# Altium project BEE-DAL_EXP.PrjPcb (part 2 of 2)

## Sheet STEP_MOTOR_DRIVER_2.SchDoc
size 420 x 297 mm; SheetNumber: 12; SheetTotal: 20
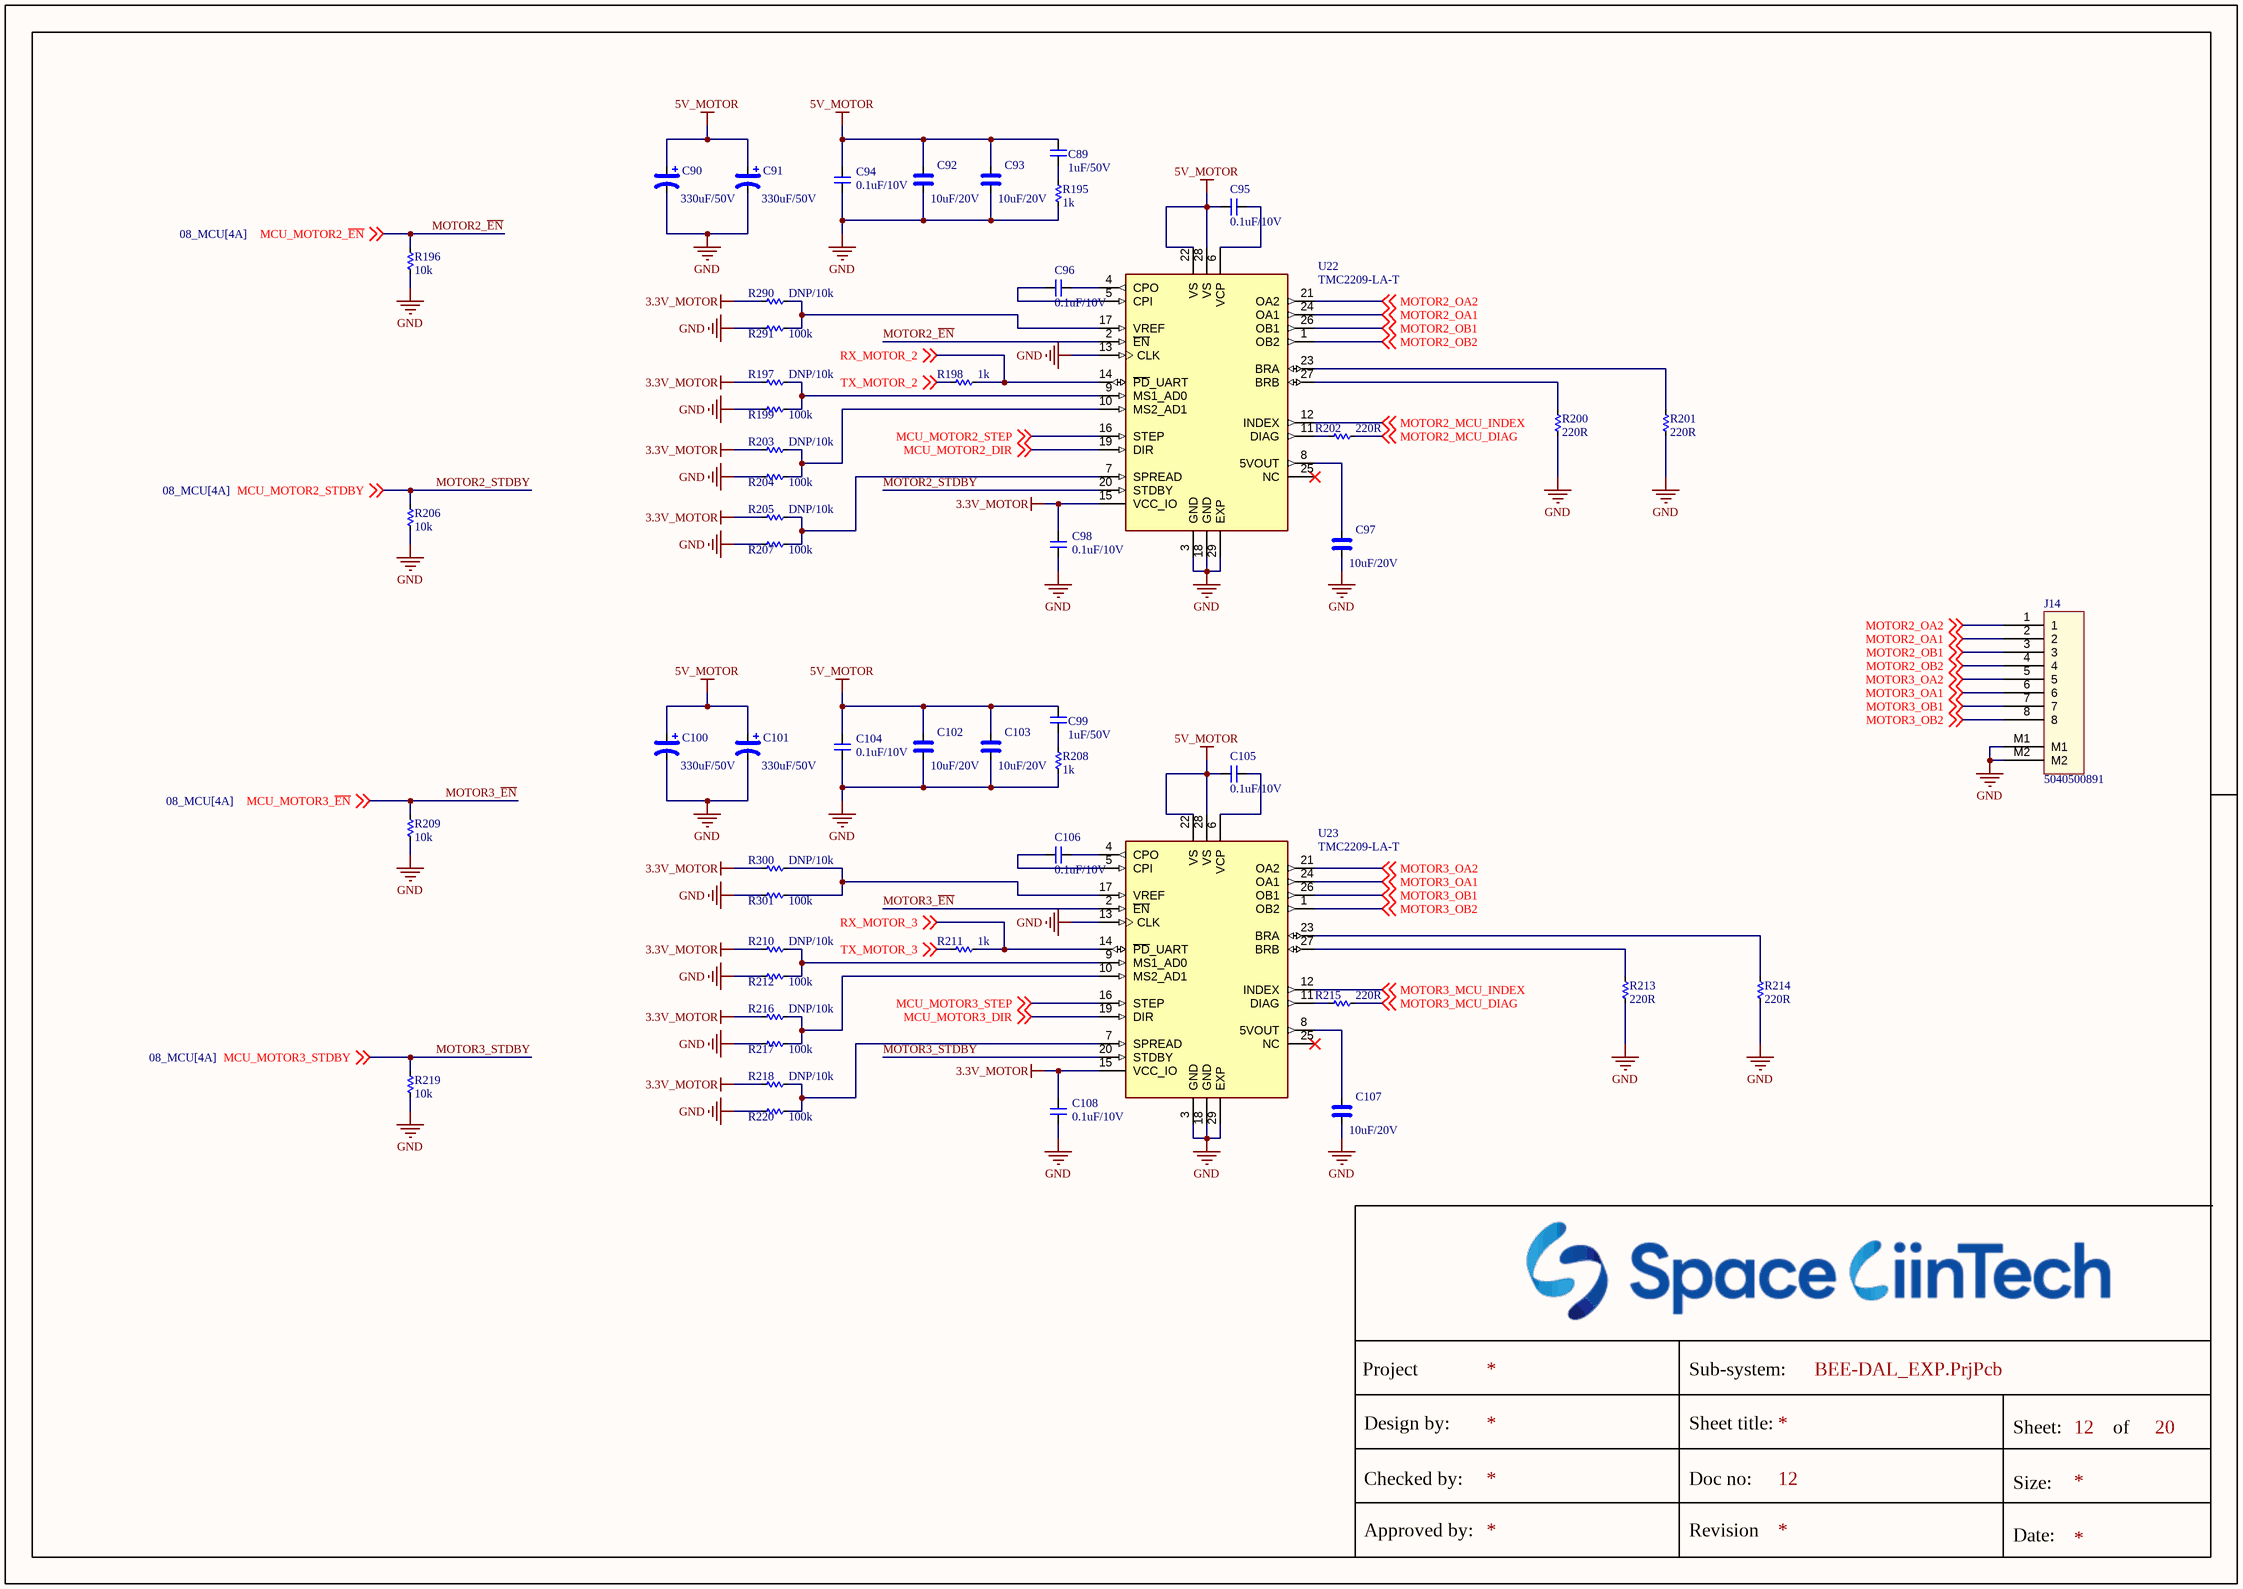
[diagram p15: STEP_MOTOR_DRIVER_2.SchDoc]

### Parts
C89  1uF/50V  [CAP_C_1005X50_L]
C90  330uF/50V  [CAP_MP_3216X180]
C91  330uF/50V  [CAP_MP_3216X180]
C92  10uF/20V  [CAP_C_2012X110]
C93  10uF/20V  [CAP_C_2012X110]
C94  0.1uF/10V  [CAP_C_1005X50_L]
C95  0.1uF/10V  [CAP_C_1005X50_L]
C96  0.1uF/10V  [CAP_C_1005X50_L]
C97  10uF/20V  [CAP_C_2012X110]
C98  0.1uF/10V  [CAP_C_1005X50_L]
C99  1uF/50V  [CAP_C_1005X50_L]
C100  330uF/50V  [CAP_MP_3216X180]
C101  330uF/50V  [CAP_MP_3216X180]
C102  10uF/20V  [CAP_C_2012X110]
C103  10uF/20V  [CAP_C_2012X110]
C104  0.1uF/10V  [CAP_C_1005X50_L]
C105  0.1uF/10V  [CAP_C_1005X50_L]
C106  0.1uF/10V  [CAP_C_1005X50_L]
C107  10uF/20V  [CAP_C_2012X110]
C108  0.1uF/10V  [CAP_C_1005X50_L]
J14  5040500891  [MOLEX_5040500891]
R195  1k  [RES_C_1005X40]
R196  10k  [RES_C_1005X40]
R197  DNP/10k  [RES_C_1005X40]
R198  1k  [RES_C_1005X40]
R199  100k  [RES_C_1005X40]
R200  220R  [RES_C_1005X40]
R201  220R  [RES_C_1005X40]
R202  220R  [RES_C_1005X40]
R203  DNP/10k  [RES_C_1005X40]
R204  100k  [RES_C_1005X40]
R205  DNP/10k  [RES_C_1005X40]
R206  10k  [RES_C_1005X40]
R207  100k  [RES_C_1005X40]
R208  1k  [RES_C_1005X40]
R209  10k  [RES_C_1005X40]
R210  DNP/10k  [RES_C_1005X40]
R211  1k  [RES_C_1005X40]
R212  100k  [RES_C_1005X40]
R213  220R  [RES_C_1005X40]
R214  220R  [RES_C_1005X40]
R215  220R  [RES_C_1005X40]
R216  DNP/10k  [RES_C_1005X40]
R217  100k  [RES_C_1005X40]
R218  DNP/10k  [RES_C_1005X40]
R219  10k  [RES_C_1005X40]
R220  100k  [RES_C_1005X40]
R290  DNP/10k  [RES_C_1005X40]
R291  100k  [RES_C_1005X40]
R300  DNP/10k  [RES_C_1005X40]
R301  100k  [RES_C_1005X40]
U22  TMC2209-LA-T  [QFN50P500X500X90-29N]
U23  TMC2209-LA-T  [QFN50P500X500X90-29N]

### Nets
3.3V_MOTOR: C98.2 C108.2 R197.2 R203.2 R205.2 R210.2 R216.2 R218.2 R290.2 R300.2 U22.15(VCC_IO) U23.15(VCC_IO)
5V_MOTOR: C89.2 C90.1 C91.1 C92.1 C93.1 C94.2 C95.2 C99.2 C100.1 C101.1 C102.1 C103.1 C104.2 C105.2 U22.22(VS) U22.28(VS) U23.22(VS) U23.28(VS)
GND: C90.2 C91.2 C92.2 C93.2 C94.1 C97.2 C98.1 C100.2 C101.2 C102.2 C103.2 C104.1 C107.2 C108.1 J14.M1 J14.M2 R195.1 R196.1 R199.2 R200.2 R201.2 R204.2 R206.1 R207.2 R208.1 R209.1 R212.2 R213.2 R214.2 R217.2 R219.1 R220.2 R291.2 R301.2 U22.3(GND) U22.13(CLK) U22.18(GND) U22.29(EXP) U23.3(GND) U23.13(CLK) U23.18(GND) U23.29(EXP)
MCU_MOTOR2_DIR: U22.19(DIR) ; off-sheet MCU_MOTOR2_DIR
MCU_MOTOR2_STEP: U22.16(STEP) ; off-sheet MCU_MOTOR2_STEP
MCU_MOTOR3_DIR: U23.19(DIR) ; off-sheet MCU_MOTOR3_DIR
MCU_MOTOR3_STEP: U23.16(STEP) ; off-sheet MCU_MOTOR3_STEP
MOTOR2_~{EN}: R196.2 U22.2(~{EN}) ; off-sheet MCU_MOTOR2_~{EN}  [also labelled MCU_MOTOR2_~{EN}]
MOTOR2_MCU_DIAG: R202.2 ; off-sheet MOTOR2_MCU_DIAG
MOTOR2_MCU_INDEX: U22.12(INDEX) ; off-sheet MOTOR2_MCU_INDEX
MOTOR2_OA1: J14.2 U22.24(OA1) ; off-sheet MOTOR2_OA1
MOTOR2_OA2: J14.1 U22.21(OA2) ; off-sheet MOTOR2_OA2
MOTOR2_OB1: J14.3 U22.26(OB1) ; off-sheet MOTOR2_OB1
MOTOR2_OB2: J14.4 U22.1(OB2) ; off-sheet MOTOR2_OB2
MOTOR2_STDBY: R206.2 U22.20(STDBY) ; off-sheet MCU_MOTOR2_STDBY  [also labelled MCU_MOTOR2_STDBY]
MOTOR3_~{EN}: R209.2 U23.2(~{EN}) ; off-sheet MCU_MOTOR3_~{EN}  [also labelled MCU_MOTOR3_~{EN}]
MOTOR3_MCU_DIAG: R215.2 ; off-sheet MOTOR3_MCU_DIAG
MOTOR3_MCU_INDEX: U23.12(INDEX) ; off-sheet MOTOR3_MCU_INDEX
MOTOR3_OA1: J14.6 U23.24(OA1) ; off-sheet MOTOR3_OA1
MOTOR3_OA2: J14.5 U23.21(OA2) ; off-sheet MOTOR3_OA2
MOTOR3_OB1: J14.7 U23.26(OB1) ; off-sheet MOTOR3_OB1
MOTOR3_OB2: J14.8 U23.1(OB2) ; off-sheet MOTOR3_OB2
MOTOR3_STDBY: R219.2 U23.20(STDBY) ; off-sheet MCU_MOTOR3_STDBY  [also labelled MCU_MOTOR3_STDBY]
RX_MOTOR_2: R198.2 U22.14(~{PD}_UART) ; off-sheet RX_MOTOR_2
RX_MOTOR_3: R211.2 U23.14(~{PD}_UART) ; off-sheet RX_MOTOR_3
TX_MOTOR_2: R198.1 ; off-sheet TX_MOTOR_2
TX_MOTOR_3: R211.1 ; off-sheet TX_MOTOR_3
NetC89_1: C89.1 R195.2
NetC95_1: C95.1 U22.6(VCP)
NetC96_1: C96.1 U22.4(CPO)
NetC96_2: C96.2 U22.5(CPI)
NetC97_1: C97.1 U22.8(5VOUT)
NetC99_1: C99.1 R208.2
NetC105_1: C105.1 U23.6(VCP)
NetC106_1: C106.1 U23.4(CPO)
NetC106_2: C106.2 U23.5(CPI)
NetC107_1: C107.1 U23.8(5VOUT)
NetR197_1: R197.1 R199.1 U22.9(MS1_AD0)
NetR200_1: R200.1 U22.27(BRB)
NetR201_1: R201.1 U22.23(BRA)
NetR202_1: R202.1 U22.11(DIAG)
NetR203_1: R203.1 R204.1 U22.10(MS2_AD1)
NetR205_1: R205.1 R207.1 U22.7(SPREAD)
NetR210_1: R210.1 R212.1 U23.9(MS1_AD0)
NetR213_1: R213.1 U23.27(BRB)
NetR214_1: R214.1 U23.23(BRA)
NetR215_1: R215.1 U23.11(DIAG)
NetR216_1: R216.1 R217.1 U23.10(MS2_AD1)
NetR218_1: R218.1 R220.1 U23.7(SPREAD)
NetR290_1: R290.1 R291.1 U22.17(VREF)
NetR300_1: R300.1 R301.1 U23.17(VREF)

Not connected (* = marked no-connect by the designer): U22 25(NC)*; U23 25(NC)*

### Notes on the sheet
- Project
- Sub-system:
- Design by:
- Sheet title:
- Sheet:
- of
- Checked by:
- Approved by:
- Doc no:
- Revision
- Size:
- Date:

### Library data of the parts
C89 C94-C96 C98 C99 C104-C106 C108 = _CAP_C_2: CAP
C90 C91 C100 C101 = _CAP_Pola_High_2: CAP Polarization High Value
C92 C93 C97 C102 C103 C107 = _CAP_C_High_2: CAP High Value
J14 = Header 8x1_2M
R195-R220 R290 R291 R300 R301 = _RES_B_2: RES
U22 U23 = TMC2209-LA-T: Bipolar Motor Driver Power MOSFET Step/Direction, UART 28-QFN (5x5); MF: Trinamic Motion Control GmbH; SnapEDA_Link: https://www.snapeda.com/parts/TMC2209-LA-T/Trinamic/view-part/?ref=snap; Package: VFQFN-28 Trinamic; Value: *; MP: TMC2209-LA-T; Check_prices: https://www.snapeda.com/parts/TMC2209-LA-T/Trinamic/view-part/?ref=eda

## Sheet STEP_MOTOR_ISOLATOR_INPUT.SchDoc
size 420 x 297 mm; SheetNumber: 12; SheetTotal: 19
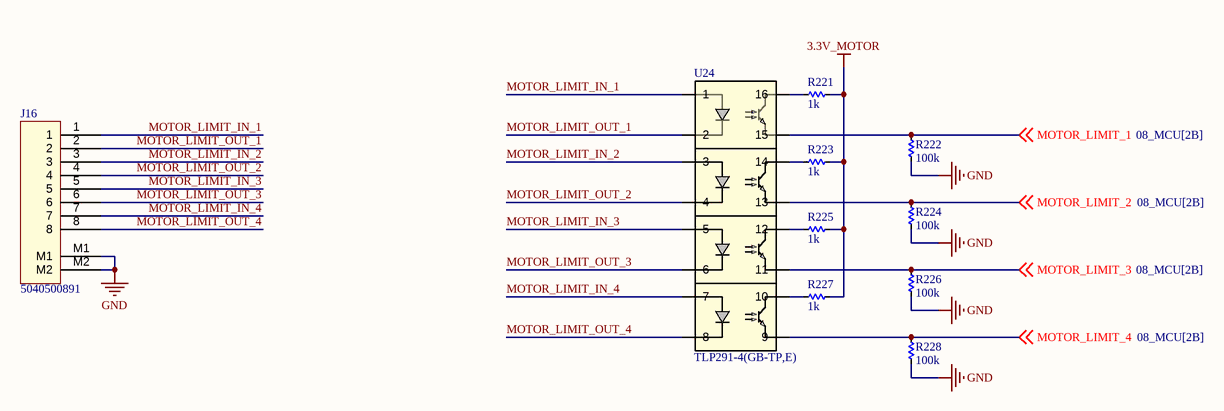
[diagram p16: STEP_MOTOR_ISOLATOR_INPUT.SchDoc]

### Parts
J16  5040500891  [MOLEX_5040500891]
R221  1k  [RES_C_1005X40]
R222  100k  [RES_C_1005X40]
R223  1k  [RES_C_1005X40]
R224  100k  [RES_C_1005X40]
R225  1k  [RES_C_1005X40]
R226  100k  [RES_C_1005X40]
R227  1k  [RES_C_1005X40]
R228  100k  [RES_C_1005X40]
U24  TLP291-4(GB-TP,E)  [SO16_TOS]

### Nets
3.3V_MOTOR: R221.1 R223.1 R225.1 R227.1
GND: J16.M1 J16.M2 R222.1 R224.1 R226.1 R228.1
MOTOR_LIMIT_1: R222.2 U24.15 ; off-sheet MOTOR_LIMIT_1
MOTOR_LIMIT_2: R224.2 U24.13 ; off-sheet MOTOR_LIMIT_2
MOTOR_LIMIT_3: R226.2 U24.11 ; off-sheet MOTOR_LIMIT_3
MOTOR_LIMIT_4: R228.2 U24.9 ; off-sheet MOTOR_LIMIT_4
MOTOR_LIMIT_IN_1: J16.1 U24.1
MOTOR_LIMIT_IN_2: J16.3 U24.3
MOTOR_LIMIT_IN_3: J16.5 U24.5
MOTOR_LIMIT_IN_4: J16.7 U24.7
MOTOR_LIMIT_OUT_1: J16.2 U24.2
MOTOR_LIMIT_OUT_2: J16.4 U24.4
MOTOR_LIMIT_OUT_3: J16.6 U24.6
MOTOR_LIMIT_OUT_4: J16.8 U24.8
NetR221_2: R221.2 U24.16
NetR223_2: R223.2 U24.14
NetR225_2: R225.2 U24.12
NetR227_2: R227.2 U24.10

### Notes on the sheet
- Project
- Sub-system:
- Design by:
- Sheet title:
- Sheet:
- of
- Checked by:
- Approved by:
- Doc no:
- Revision
- Size:
- Date:

### Library data of the parts
J16 = Header 8x1_2M
R221-R228 = _RES_B_2: RES
U24 = TLP291-4GB-TP,E: Description; Manufacturer_Name: Toshiba Electronic Devices & Storage Corp.; Source_Package: TLP291_4; Number_devices_in_Package: 1; Copyright: Copyright (C) 2026 Ultra Librarian. All rights reserved.; Manufacturer_Part_Number: TLP291-4(GB-TP,E); RefDes: Refdes; Type: Type

## Sheet CONNECTOR_INTERFACE.SchDoc
size 420 x 297 mm; SheetNumber: 14; SheetTotal: 20
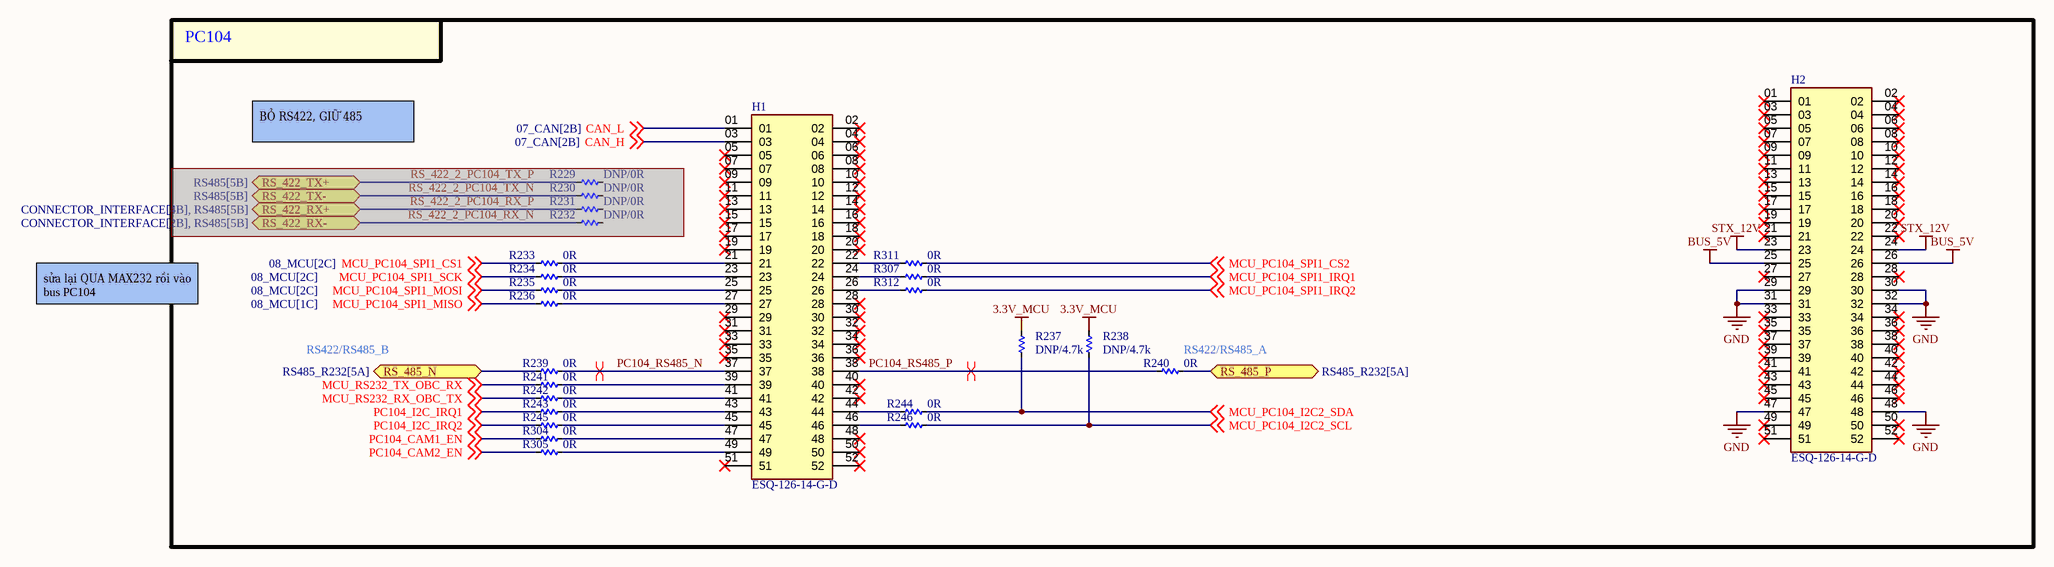
[diagram p17: CONNECTOR_INTERFACE.SchDoc]

### Parts
(Parts that share a designator on the sheet are numbered #1, #2 ... from top to bottom, then left to right.)
H1  ESQ-126-14-G-D  [SAMTEC_ESQ-126-14-G-D]
H2  ESQ-126-14-G-D  [SAMTEC_ESQ-126-14-G-D]
R229  DNP/0R  [RES_C_1005x30_L]  (masked out: inside a compile mask, not in the netlist)
R230  DNP/0R  [RES_C_1005x30_L]  (masked out: inside a compile mask, not in the netlist)
R231#2  DNP/0R  [RES_C_1005x30_L]  (masked out: inside a compile mask, not in the netlist)
R232#2  DNP/0R  [RES_C_1005x30_L]  (masked out: inside a compile mask, not in the netlist)
R233  0R  [RES_C_1005x30_L]
R234  0R  [RES_C_1005x30_L]
R235  0R  [RES_C_1005x30_L]
R236  0R  [RES_C_1005x30_L]
R237  DNP/4.7k  [RES_C_1005x30_L]
R238  DNP/4.7k  [RES_C_1005x30_L]
R239  0R  [RES_C_1005x30_L]
R240  0R  [RES_C_1005x30_L]
R241  0R  [RES_C_1005x30_L]
R242  0R  [RES_C_1005x30_L]
R243  0R  [RES_C_1005x30_L]
R244  0R  [RES_C_1005x30_L]
R245  0R  [RES_C_1005x30_L]
R246  0R  [RES_C_1005x30_L]
R304  0R  [RES_C_1005x30_L]
R305  0R  [RES_C_1005x30_L]
R307  0R  [RES_C_1005x30_L]
R311  0R  [RES_C_1005x30_L]
R312  0R  [RES_C_1005x30_L]

### Ports
RS_422_RX+ (bidir, see CONNECTOR_INTERFACE[4B], RS485[5B]), RS_422_RX- (bidir, see CONNECTOR_INTERFACE[2B], RS485[5B]), RS_422_TX+ (bidir, see RS485[5B]), RS_422_TX- (bidir, see RS485[5B]), RS_485_N (bidir, see RS485_R232[5A]), RS_485_P (bidir, see RS485_R232[5A])

### Nets
3.3V_MCU: R237.2 R238.2
BUS_5V: H2.25 H2.26
GND: H2.29 H2.30 H2.31 H2.32 H2.47 H2.48
STX_12V: H2.23 H2.24
CAN_H: H1.03 ; off-sheet CAN_H
CAN_L: H1.01 ; off-sheet CAN_L
MCU_PC104_I2C2_SCL: R238.1 R246.2 ; off-sheet MCU_PC104_I2C2_SCL
MCU_PC104_I2C2_SDA: R237.1 R244.2 ; off-sheet MCU_PC104_I2C2_SDA
MCU_PC104_SPI1_CS1: R233.1 ; off-sheet MCU_PC104_SPI1_CS1
MCU_PC104_SPI1_CS2: R311.1 ; off-sheet MCU_PC104_SPI1_CS2
MCU_PC104_SPI1_IRQ1: R307.2 ; off-sheet MCU_PC104_SPI1_IRQ1
MCU_PC104_SPI1_IRQ2: R312.2 ; off-sheet MCU_PC104_SPI1_IRQ2
MCU_PC104_SPI1_MISO: R236.1 ; off-sheet MCU_PC104_SPI1_MISO
MCU_PC104_SPI1_MOSI: R235.1 ; off-sheet MCU_PC104_SPI1_MOSI
MCU_PC104_SPI1_SCK: R234.1 ; off-sheet MCU_PC104_SPI1_SCK
MCU_RS232_RX_OBC_TX: R242.1 ; off-sheet MCU_RS232_RX_OBC_TX
MCU_RS232_TX_OBC_RX: R241.1 ; off-sheet MCU_RS232_TX_OBC_RX
PC104_CAM1_EN: R304.1 ; off-sheet PC104_CAM1_EN
PC104_CAM2_EN: R305.1 ; off-sheet PC104_CAM2_EN
PC104_I2C_IRQ1: R243.1 ; off-sheet PC104_I2C_IRQ1
PC104_I2C_IRQ2: R245.1 ; off-sheet PC104_I2C_IRQ2
PC104_RS485_N: H1.37 R239.2
PC104_RS485_P: H1.38 R240.1
NetH1_21: H1.21 R233.2
NetH1_22: H1.22 R311.2
NetH1_23: H1.23 R234.2
NetH1_24: H1.24 R307.1
NetH1_25: H1.25 R235.2
NetH1_26: H1.26 R312.1
NetH1_27: H1.27 R236.2
NetH1_39: H1.39 R241.2
NetH1_41: H1.41 R242.2
NetH1_43: H1.43 R243.2
NetH1_44: H1.44 R244.1
NetH1_45: H1.45 R245.2
NetH1_46: H1.46 R246.1
NetH1_47: H1.47 R304.2
NetH1_49: H1.49 R305.2
NetR239_1: R239.1 ; port RS_485_N
NetR240_2: R240.2 ; port RS_485_P

Not connected (* = marked no-connect by the designer): H1 02* 04* 05* 06* 07* 08* 09* 10* 11* 12* 13* 14* 15* 16* 17* 18* 19* 20* 28* 29* 30* 31* 32* 33* 34* 35* 36* 40* 42* 48* 50* 51* 52*; H2 01* 02* 03* 04* 05* 06* 07* 08* 09* 10* 11* 12* 13* 14* 15* 16* 17* 18* 19* 20* 21* 22* 27* 28* 33* 34* 35* 36* 37* 38* 39* 40* 41* 42* 43* 44* 45* 46* 49* 50* 51* 52*

### Layout directives
differential pair: PC104_RS485_N, PC104_RS485_P

### Notes on the sheet
- PC104
- BỎ RS422, GIỮ 485
- sửa lại QUA MAX232 rồi vào bus PC104
- RS422/RS485_B
- (near R240) RS422/RS485_A
- Project:
- Sub-system:
- Design by:
- Sheet title:
- Sheet
- A3
- of
- Checked by:
- Approved by:
- Revision:
- Document No:
- Size:
- Date:

### Library data of the parts
H1 H2 = ESQ-126-14-G-D: CONN SOCKET 52POS 0.1 GOLD PCB; MF: Samtec; MP: ESQ-126-14-G-D; Price: None; Package: None; Value: *; Availability: Unavailable
R229 R230 R231#2 R232#2 R233-R246 R304 R305 R307 R311 R312 = _RES_B_2: RES

## Sheet POWER_MEASUREMENT.SchDoc
size 420 x 297 mm; SheetNumber: 15; SheetTotal: 20
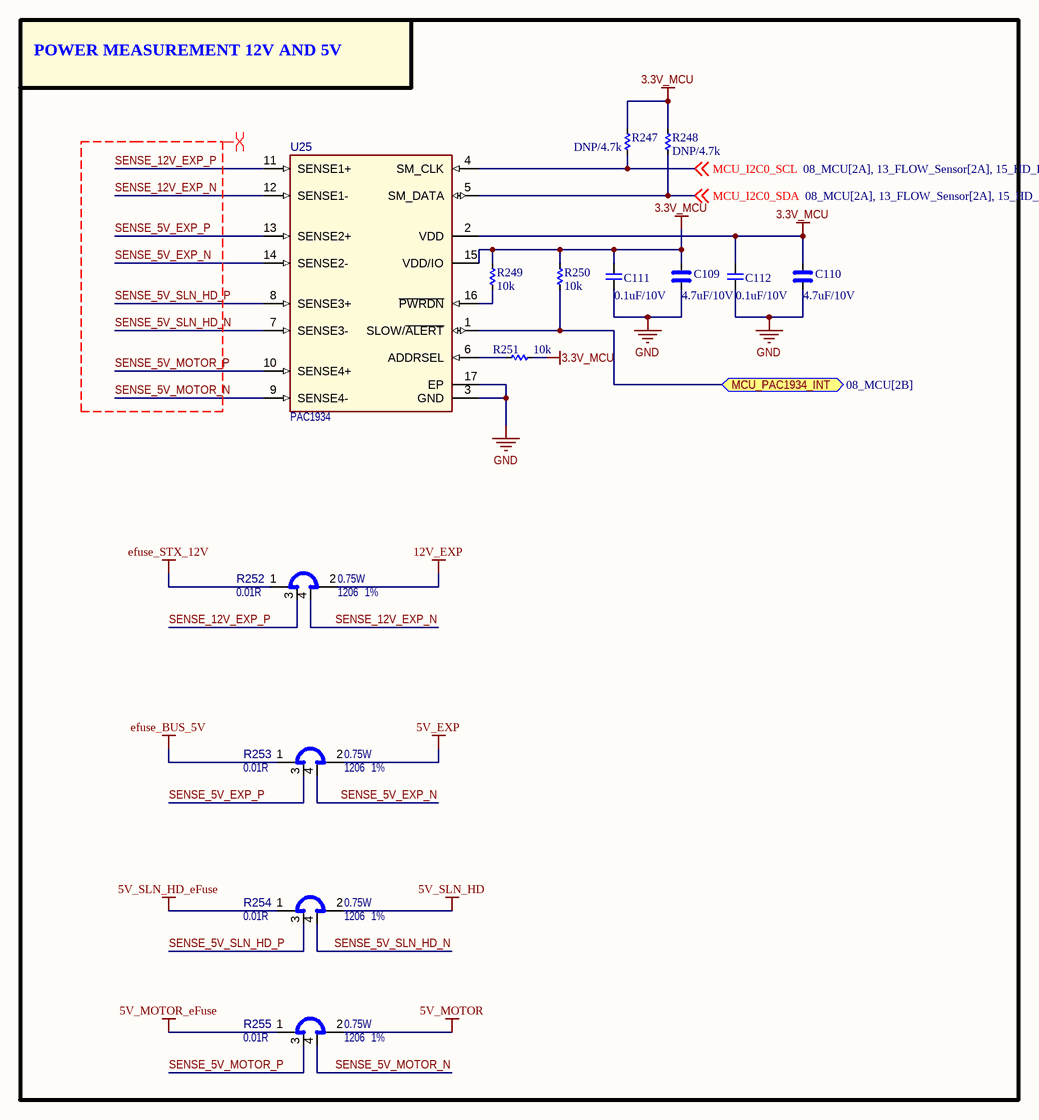
[diagram p18: POWER_MEASUREMENT.SchDoc]

### Parts
C109  4.7uF/10V  [CAP_C_1005X50_L]
C110  4.7uF/10V  [CAP_C_1005X50_L]
C111  0.1uF/10V  [CAP_C_1005X50_L]
C112  0.1uF/10V  [CAP_C_1005X50_L]
R247  DNP/4.7k  [RES_C_1005x30_L]
R248  DNP/4.7k  [RES_C_1005x30_L]
R249  10k  [RES_C_1005x30_L]
R250  10k  [RES_C_1005x30_L]
R251  10k  [RES_C_1005x30_L]
R252  value 0.01R  Package: 1206  Tolerance: 1%  Power: 0.75W  [RES_C_1206_SHUNT]  (hidden comment: KRL1632E-M-R010-F-T5)
R253  value 0.01R  Package: 1206  Tolerance: 1%  Power: 0.75W  [RES_C_1206_SHUNT]  (hidden comment: KRL1632E-M-R010-F-T5)
R254  value 0.01R  Package: 1206  Tolerance: 1%  Power: 0.75W  [RES_C_1206_SHUNT]  (hidden comment: KRL1632E-M-R010-F-T5)
R255  value 0.01R  Package: 1206  Tolerance: 1%  Power: 0.75W  [RES_C_1206_SHUNT]  (hidden comment: KRL1632E-M-R010-F-T5)
U25  value PAC1934  [UQFN-16_4X4_EP2.6X2.6]  (hidden comment: PAC1934 UQFN-16)

### Blocks framed on the sheet
POWER MEASUREMENT 12V AND 5V: C109-C112 R247-R255 U25

### Ports
MCU_PAC1934_INT (bidir, see 08_MCU[2B])

### Nets
3.3V_MCU: C109.1 C110.1 C111.1 C112.1 R247.1 R248.1 R249.1 R250.1 R251.2 U25.2(VDD) U25.15(VDD/IO)
5V_EXP: R253.2
5V_MOTOR: R255.2
5V_MOTOR_eFuse: R255.1
5V_SLN_HD: R254.2
5V_SLN_HD_eFuse: R254.1
12V_EXP: R252.2
efuse_BUS_5V: R253.1
efuse_STX_12V: R252.1
GND: C109.2 C110.2 C111.2 C112.2 U25.3(GND) U25.17(EP)
MCU_I2C0_SCL: R247.2 U25.4(SM_CLK) ; off-sheet MCU_I2C0_SCL
MCU_I2C0_SDA: R248.2 U25.5(SM_DATA) ; off-sheet MCU_I2C0_SDA
SENSE_5V_EXP_N: R253.4 U25.14(SENSE2-)
SENSE_5V_EXP_P: R253.3 U25.13(SENSE2+)
SENSE_5V_MOTOR_N: R255.4 U25.9(SENSE4-)
SENSE_5V_MOTOR_P: R255.3 U25.10(SENSE4+)
SENSE_5V_SLN_HD_N: R254.4 U25.7(SENSE3-)
SENSE_5V_SLN_HD_P: R254.3 U25.8(SENSE3+)
SENSE_12V_EXP_N: R252.4 U25.12(SENSE1-)
SENSE_12V_EXP_P: R252.3 U25.11(SENSE1+)
NetR61_2: R250.2 U25.1(SLOW/~{ALERT}) ; port MCU_PAC1934_INT
NetR249_2: R249.2 U25.16(~{PWRDN})
NetR251_1: R251.1 U25.6(ADDRSEL)

### Layout directives
differential pair: SENSE_5V_EXP_N, SENSE_5V_EXP_P, SENSE_5V_MOTOR_N, SENSE_5V_MOTOR_P, SENSE_5V_SLN_HD_N, SENSE_5V_SLN_HD_P, SENSE_12V_EXP_N, SENSE_12V_EXP_P

### Notes on the sheet
- Project
- Sub-system:
- Design by:
- Sheet title:
- Sheet:
- of
- Checked by:
- Approved by:
- Doc no:
- Revision
- Size:
- Date:

### Library data of the parts
C109 C110 = _CAP_C_High_2: CAP
C111 C112 = _CAP_C_2: CAP
R247-R251 = _RES_B_2: RES
R252-R255 = RSMT1316: Shunt; Manufacturer 1: SUSUMU; Description_: RES SHUNT MF 0.01R 1% 0.75W SMD 1206; Dev Tools Status: Design; Temperature Coeffcient: 50ppm/C; Current: 8A; Owner: Ciprian Abramov; Populated: YES; MCHP-ID: RSMT1316; Revision: 1; Symbol: Shunt 4 Pin; Status: MCL Design; ComponentLink1URL: https://chn-vm-apps.microchip.com/mchprepo/parts/Datasheets/n_catalog_partition09_en.pdf; ComponentLink1Description: SVN Datasheet; ComponentLink2URL: C:\ALTIUM_WORK\00001_MCHP-CDB\Datasheets\n_catalog_partition09_en.pdf; ComponentLink2Description: Local Datasheet; ComponentLink3URL: C:\ALTIUM_WORK\00001_MCHP-CDB\Library\LibraryRefs\Shunt 4 Pin.SchLib; ComponentLink3Description: Open Symbol; ComponentLink4URL: C:\ALTIUM_WORK\00001_MCHP-CDB\Library\Footprints\RES_C_1206_SHUNT.PcbLib; ComponentLink4Description: Open Footprint; ComponentLink5Description: Open Footprint 2; ComponentLink6Description: Open Footprint 3; ComponentLink7Description: Open Footprint 4; Operating Temperature: -55C to +155C; Category: Resistor; Type: RES SMD; Composition: MF; Manufacturer Part Number 1: KRL1632E-M-R010-F-T5; Supplier 1: Digi-Key; Supplier Part Number 1: 408-1570-1-ND; Quantity Override: 1
U25 = MIC8883: Manufacturer 1: Microchip Technology; Manufacturer Part Number 1: PAC1934T-I/JQ; Description_: MCHP ANALOG POWER CURRENT SENSE MONITOR PAC1934T-I/JQ UQFN-16; Dev Tools Status: Design; Owner: Ciprian Abramov; Populated: YES; MCHP-ID: MIC8883; Symbol: PAC1934 UQFN-16; Type: Power/Current Sensor; Status: MCL Design; Revision: 1; Category: MCHP-Analog; ComponentLink1Description: SVN Datasheet; ComponentLink2Description: Local Datasheet; ComponentLink3URL: C:\ALTIUM_WORK\00001_MCHP-CDB\Library\LibraryRefs\PAC1934 UQFN-16.SchLib; ComponentLink3Description: Open Symbol; ComponentLink4URL: C:\ALTIUM_WORK\00001_MCHP-CDB\Library\Footprints\UQFN-16_4X4_EP2.6X2.6.PcbLib; ComponentLink4Description: Open Footprint; ComponentLink5Description: Open Footprint 2; ComponentLink6Description: Open Footprint 3; ComponentLink7Description: Open Footprint 4; Supplier 1: Digi-Key; Supplier Part Number 1: PAC1934T-I/JQCT-ND; Quantity Override: 1

## Sheet POWER.SchDoc
size 420 x 297 mm; SheetNumber: 16; SheetTotal: 19
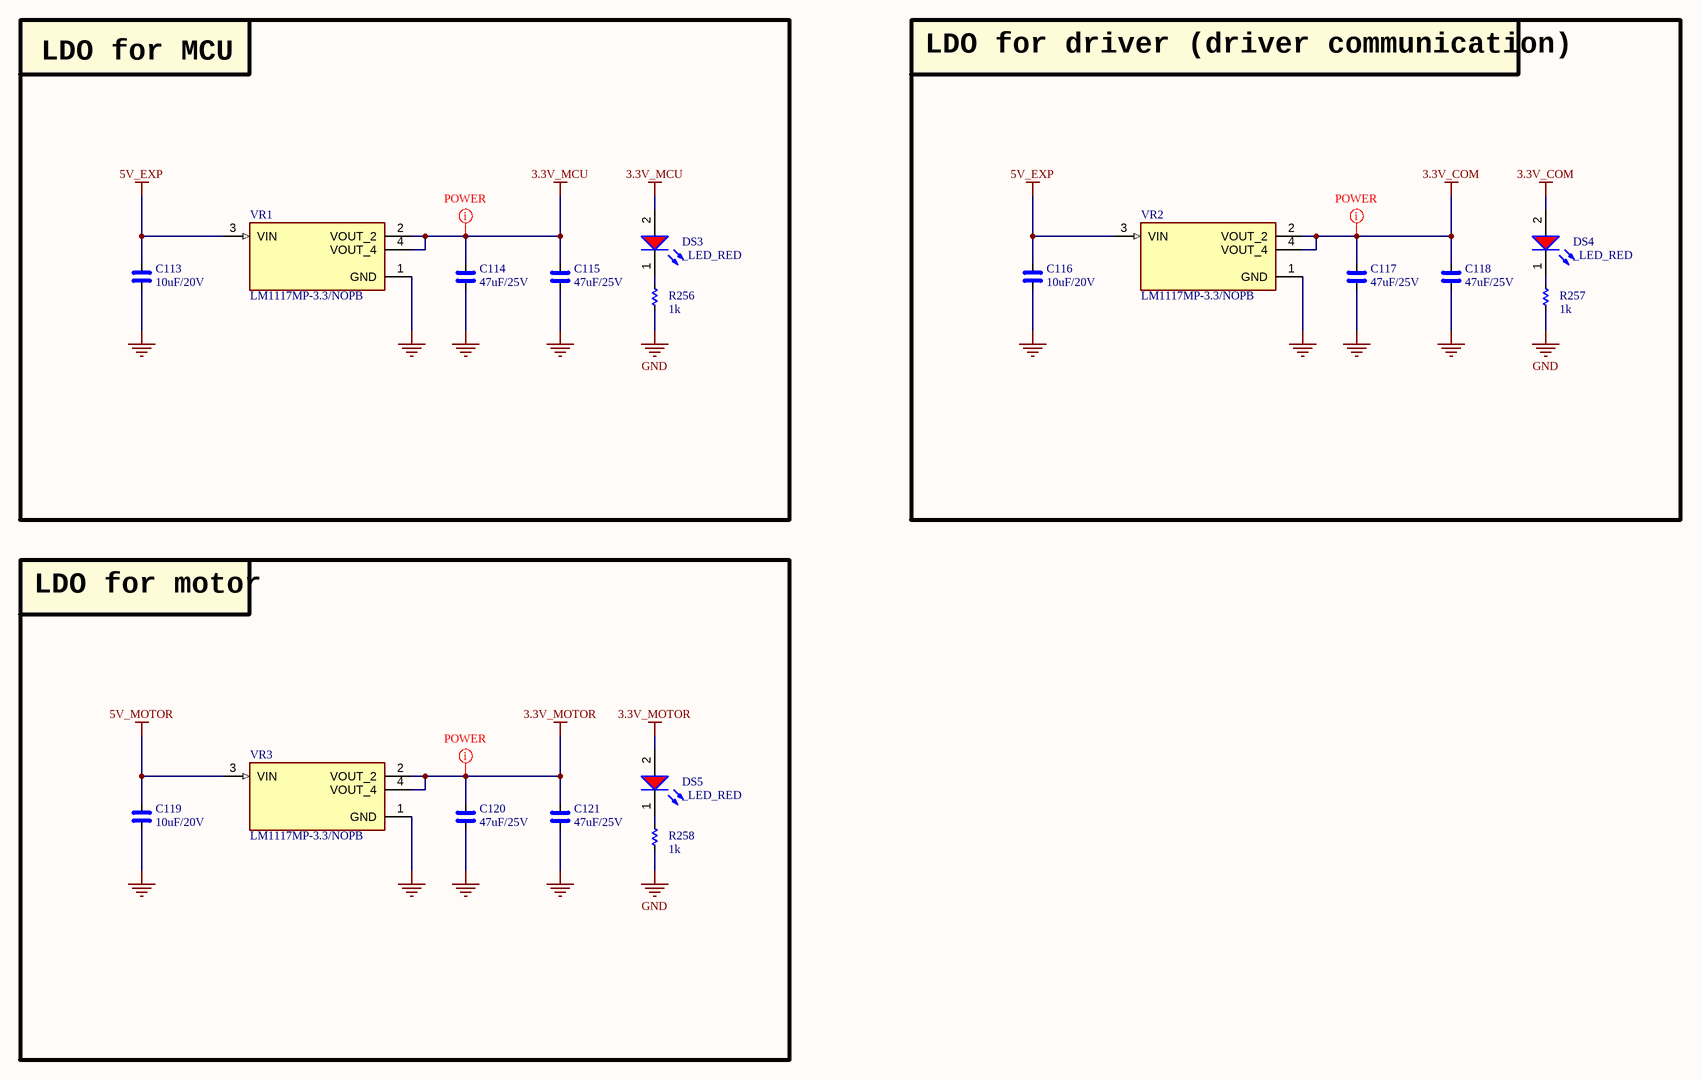
[diagram p19: POWER.SchDoc]

### Parts
C113  10uF/20V  [CAP_C_2012X110]
C114  47uF/25V  [CAP_C_3225X80]
C115  47uF/25V  [CAP_C_3225X80]
C116  10uF/20V  [CAP_C_2012X110]
C117  47uF/25V  [CAP_C_3225X80]
C118  47uF/25V  [CAP_C_3225X80]
C119  10uF/20V  [CAP_C_2012X110]
C120  47uF/25V  [CAP_C_3225X80]
C121  47uF/25V  [CAP_C_3225X80]
DS3  _LED_RED  [LED_0603]
DS4  _LED_RED  [LED_0603]
DS5  _LED_RED  [LED_0603]
R256  1k  [RES_C_1005X40]
R257  1k  [RES_C_1005X40]
R258  1k  [RES_C_1005X40]
VR1  LM1117MP-3.3/NOPB  [VREG_LM1117MP-3.3/NOPB]
VR2  LM1117MP-3.3/NOPB  [VREG_LM1117MP-3.3/NOPB]
VR3  LM1117MP-3.3/NOPB  [VREG_LM1117MP-3.3/NOPB]

### Blocks framed on the sheet
LDO for MCU: C113-C115 DS3 R256 VR1
LDO for driver (driver communication): C116-C118 DS4 R257 VR2
LDO for motor: C119-C121 DS5 R258 VR3

### Nets
3.3V_COM: C117.2 C118.2 DS4.2(A) VR2.2(VOUT_2) VR2.4(VOUT_4)
3.3V_MCU: C114.2 C115.2 DS3.2(A) VR1.2(VOUT_2) VR1.4(VOUT_4)
3.3V_MOTOR: C120.2 C121.2 DS5.2(A) VR3.2(VOUT_2) VR3.4(VOUT_4)
5V_EXP: C113.1 C116.1 VR1.3(VIN) VR2.3(VIN)
5V_MOTOR: C119.1 VR3.3(VIN)
GND: C113.2 C114.1 C115.1 C116.2 C117.1 C118.1 C119.2 C120.1 C121.1 R256.1 R257.1 R258.1 VR1.1(GND) VR2.1(GND) VR3.1(GND)
NetDS3_1: DS3.1(K) R256.2
NetDS4_1: DS4.1(K) R257.2
NetDS5_1: DS5.1(K) R258.2

### Layout directives
net class POWER: 3.3V_COM, 3.3V_MCU, 3.3V_MOTOR

### Notes on the sheet
- Project
- Sub-system:
- Design by:
- Sheet title:
- Sheet:
- of
- Checked by:
- Approved by:
- Doc no:
- Revision
- Size:
- Date:

### Library data of the parts
C113-C121 = _CAP_C_High_2: CAP High Value
R256-R258 = _RES_B_2: RES
VR1-VR3 = LM1117MP-3.3/NOPB: 800-mA 15-V linear voltage regulator; MF: Texas Instruments; SnapEDA_Link: https://www.snapeda.com/parts/LM1117MP-3.3/NOPB/Texas+Instruments/view-part/?ref=snap; Package: SOT-223-4 Texas Instruments; Value: *; MP: LM1117MP-3.3/NOPB; Check_prices: https://www.snapeda.com/parts/LM1117MP-3.3/NOPB/Texas+Instruments/view-part/?ref=eda

## Sheet FUNCTION_EFUSE.SchDoc
size 420 x 297 mm; SheetNumber: 17; SheetTotal: 20
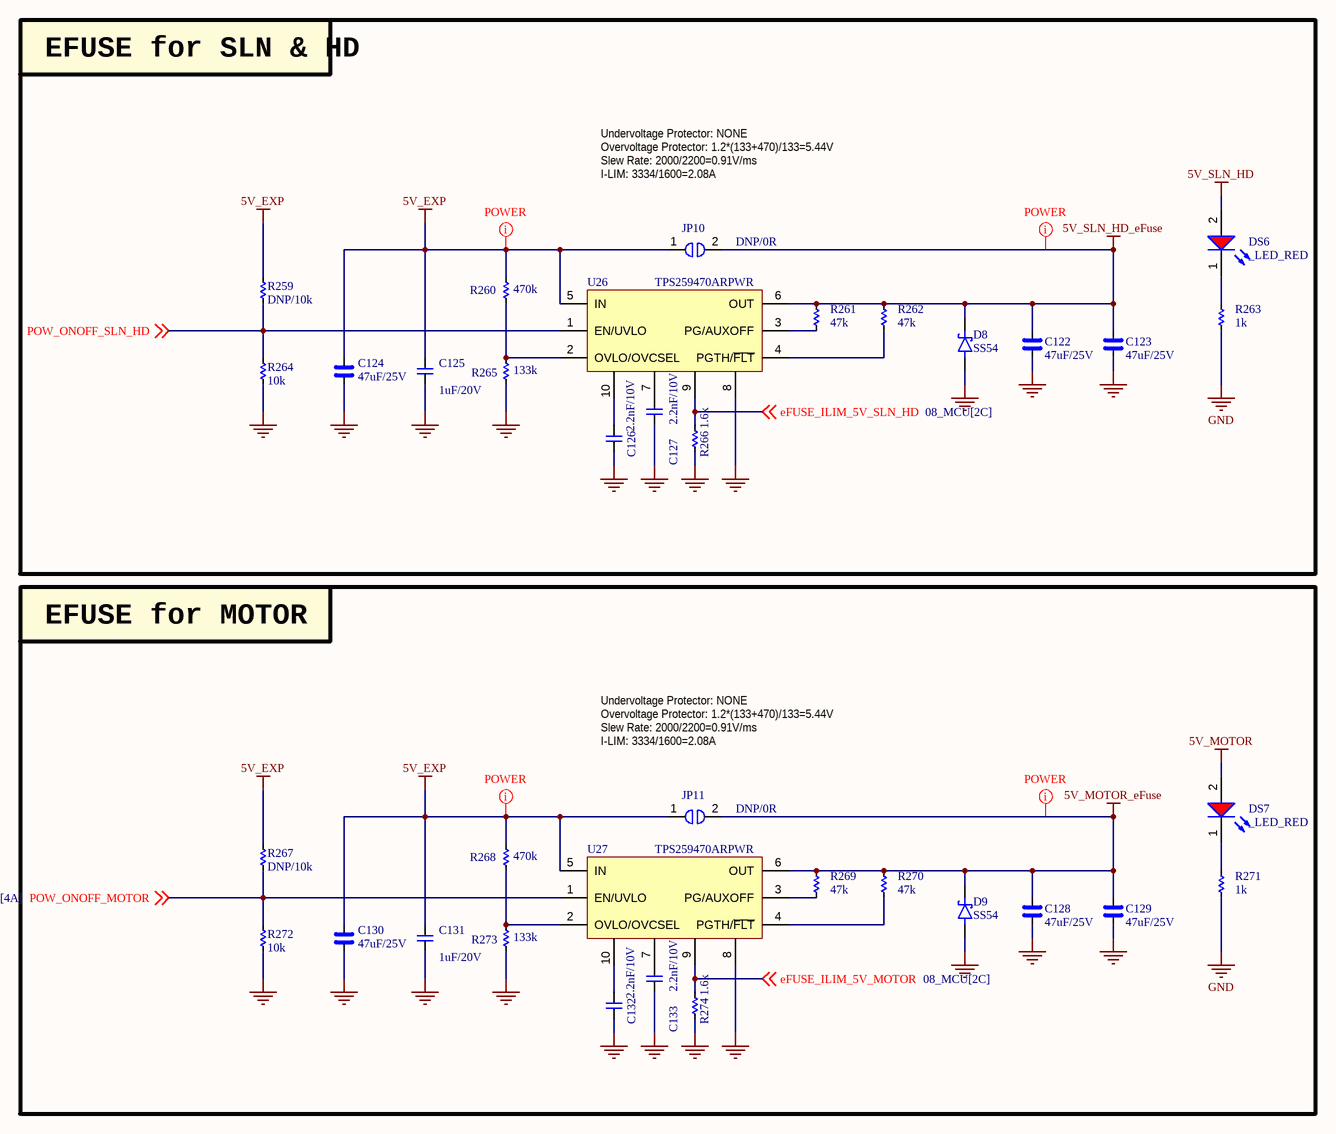
[diagram p20: FUNCTION_EFUSE.SchDoc]

### Parts
C122  47uF/25V  [CAP_C_3225X80]
C123  47uF/25V  [CAP_C_3225X80]
C124  47uF/25V  [CAP_C_3225X80]
C125  1uF/20V  [CAP_C_1005X50_L]
C126  2.2nF/10V  [CAP_C_1005X50_L]
C127  2.2nF/10V  [CAP_C_1005X50_L]
C128  47uF/25V  [CAP_C_3225X80]
C129  47uF/25V  [CAP_C_3225X80]
C130  47uF/25V  [CAP_C_3225X80]
C131  1uF/20V  [CAP_C_1005X50_L]
C132  2.2nF/10V  [CAP_C_1005X50_L]
C133  2.2nF/10V  [CAP_C_1005X50_L]
D8  SS54  [DO-214AC_SMA]
D9  SS54  [DO-214AC_SMA]
DS6  _LED_RED  [LED_0603]
DS7  _LED_RED  [LED_0603]
JP10  DNP/0R  [JUMPER_1608]
JP11  DNP/0R  [JUMPER_1608]
R259  DNP/10k  [RES_C_1005X40]
R260  470k  [RES_C_1005X40]
R261  47k  [RES_C_1005X40]
R262  47k  [RES_C_1005X40]
R263  1k  [RES_C_1005X40]
R264  10k  [RES_C_1005X40]
R265  133k  [RES_C_1005X40]
R266  1.6k  [RES_C_1005X40]
R267  DNP/10k  [RES_C_1005X40]
R268  470k  [RES_C_1005X40]
R269  47k  [RES_C_1005X40]
R270  47k  [RES_C_1005X40]
R271  1k  [RES_C_1005X40]
R272  10k  [RES_C_1005X40]
R273  133k  [RES_C_1005X40]
R274  1.6k  [RES_C_1005X40]
U26  TPS259470ARPWR  [VQFN-HR-10]
U27  TPS259470ARPWR  [VQFN-HR-10]

### Blocks framed on the sheet
EFUSE for SLN & HD: C122-C127 D8 DS6 JP10 R259-R266 U26
EFUSE for MOTOR: C128-C133 D9 DS7 JP11 R267-R274 U27

### Nets
5V_EXP: C124.2 C125.2 C130.2 C131.2 JP10.1 JP11.1 R259.1 R260.2 R267.1 R268.2 U26.5(IN) U27.5(IN)
5V_MOTOR: DS7.2(A)
5V_MOTOR_eFuse: C128.2 C129.2 D9.1(K) JP11.2 R269.2 R270.2 U27.6(OUT)
5V_SLN_HD: DS6.2(A)
5V_SLN_HD_eFuse: C122.2 C123.2 D8.1(K) JP10.2 R261.2 R262.2 U26.6(OUT)
GND: C122.1 C123.1 C124.1 C125.1 C126.1 C127.1 C128.1 C129.1 C130.1 C131.1 C132.1 C133.1 D8.2(A) D9.2(A) R263.1 R264.2 R265.1 R266.1 R271.1 R272.2 R273.1 R274.1 U26.8 U27.8
eFUSE_ILIM_5V_MOTOR: R274.2 U27.9 ; off-sheet eFUSE_ILIM_5V_MOTOR
eFUSE_ILIM_5V_SLN_HD: R266.2 U26.9 ; off-sheet eFUSE_ILIM_5V_SLN_HD
POW_ONOFF_MOTOR: R267.2 R272.1 U27.1(EN/UVLO) ; off-sheet POW_ONOFF_MOTOR
POW_ONOFF_SLN_HD: R259.2 R264.1 U26.1(EN/UVLO) ; off-sheet POW_ONOFF_SLN_HD
NetC126_2: C126.2 U26.10
NetC127_2: C127.2 U26.7
NetC132_2: C132.2 U27.10
NetC133_2: C133.2 U27.7
NetDS6_1: DS6.1(K) R263.2
NetDS7_1: DS7.1(K) R271.2
NetR260_1: R260.1 R265.2 U26.2(OVLO/OVCSEL)
NetR261_1: R261.1 U26.3(PG/AUXOFF)
NetR262_1: R262.1 U26.4(PGTH/~{FLT})
NetR268_1: R268.1 R273.2 U27.2(OVLO/OVCSEL)
NetR269_1: R269.1 U27.3(PG/AUXOFF)
NetR270_1: R270.1 U27.4(PGTH/~{FLT})

### Layout directives
net class POWER: 5V_EXP, 5V_MOTOR_eFuse, 5V_SLN_HD_eFuse

### Notes on the sheet
- Undervoltage Protector: NONE
- Overvoltage Protector: 1.2*(133+470)/133=5.44V
- Slew Rate: 2000/2200=0.91V/ms
- I-LIM: 3334/1600=2.08A
- Project
- Sub-system:
- Design by:
- Sheet title:
- Sheet:
- of
- Checked by:
- Approved by:
- Doc no:
- Revision
- Size:
- Date:

### Library data of the parts
C122-C124 C128-C130 = _CAP_C_High_2: CAP High Value
C125-C127 C131-C133 = _CAP_C_2: CAP
D8 D9 = DIODE SCHOTTKY
JP10 JP11 = JUMPER_1_1
R259-R274 = _RES_B_2: RES

## Sheet RS485.SchDoc
size 420 x 297 mm; SheetNumber: 17; SheetTotal: 18
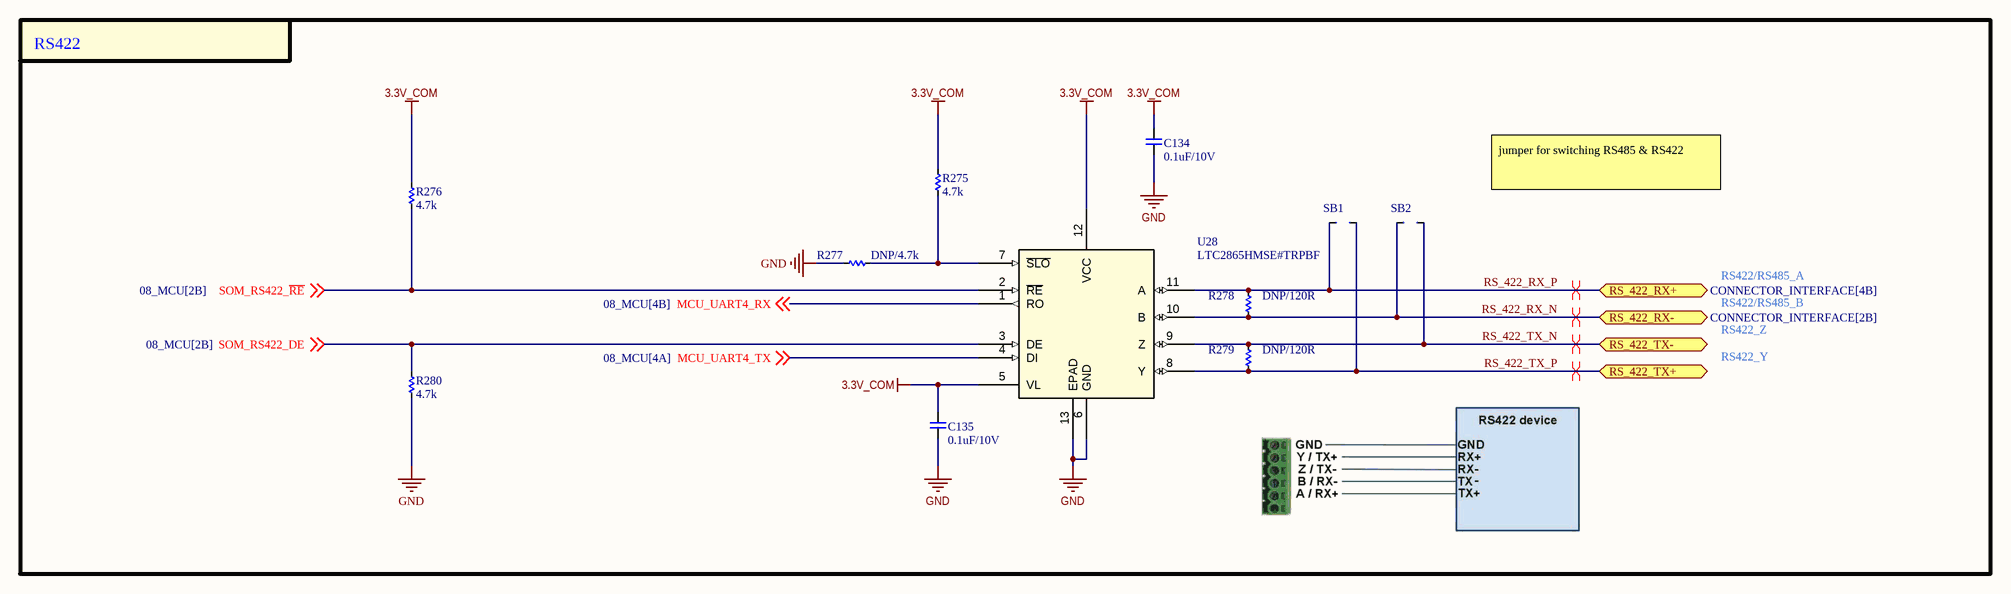
[diagram p21: RS485.SchDoc]

### Parts
(Parts that share a designator on the sheet are numbered #1, #2 ... from top to bottom, then left to right.)
C134  0.1uF/10V  [CAP_C_1005X50_L]
C135#2  0.1uF/10V  [CAP_C_1005X50_L]
R275  4.7k  [RES_C_1005x30_L]
R276  4.7k  [RES_C_1005x30_L]
R277  DNP/4.7k  [RES_C_1005x30_L]
R278  DNP/120R  [RES_C_1005x30_L]
R279  DNP/120R  [RES_C_1005x30_L]
R280#2  4.7k  [RES_C_1005x30_L]
SB1  JUMPER  [JUMPER_1608]  (value not drawn)
SB2  JUMPER  [JUMPER_1608]  (value not drawn)
U28#2  LTC2865HMSE#TRPBF  [MSOP-12_MSE_LIT]

### Ports
RS_422_RX+ (bidir, see CONNECTOR_INTERFACE[4B]), RS_422_RX- (bidir, see CONNECTOR_INTERFACE[2B]), RS_422_TX+ (bidir), RS_422_TX- (bidir)

### Nets
3.3V_COM: C134.2 C135#2.2 R275.2 R276.2 U28#2.5(VL) U28#2.12(VCC)
GND: C134.1 C135#2.1 R277.2 R280#2.1 U28#2.6(GND) U28#2.13(EPAD)
MCU_UART4_RX: U28#2.1(RO) ; off-sheet MCU_UART4_RX
MCU_UART4_TX: U28#2.4(DI) ; off-sheet MCU_UART4_TX
RS_422_RX_N: R278.2 SB2.1 U28#2.10(B) ; port RS_422_RX-
RS_422_RX_P: R278.1 SB1.1 U28#2.11(A) ; port RS_422_RX+
RS_422_TX_N: R279.1 SB2.2 U28#2.9(Z) ; port RS_422_TX-
RS_422_TX_P: R279.2 SB1.2 U28#2.8(Y) ; port RS_422_TX+
SOM_RS422_DE: R280#2.2 U28#2.3(DE) ; off-sheet SOM_RS422_DE
SOM_RS422_~{RE}: R276.1 U28#2.2(~{RE}) ; off-sheet SOM_RS422_~{RE}
NetR275_1: R275.1 R277.1 U28#2.7(~{SLO})

### Layout directives
differential pair: RS_422_RX_N, RS_422_RX_P, RS_422_TX_N, RS_422_TX_P

### Notes on the sheet
- RS422
- jumper for switching RS485 & RS422
- RS422/RS485_A
- RS422/RS485_B
- RS422_Z
- RS422_Y
- Project
- Sub-system:
- Design by:
- Sheet title:
- Sheet:
- of
- Checked by:
- Approved by:
- Doc no:
- Revision
- Size:
- Date:

### Library data of the parts
C134 C135#2 = _CAP_C_2: CAP
R275-R279 R280#2 = _RES_B_2: RES
U28#2 = LTC2865HMSETRPBF: Â±60V Fault Protected 3V to 5.5V RS485/RS422 Transceivers; Manufacturer_Name: Analog Devices Inc; Copyright: Copyright (C) 2025 Ultra Librarian. All rights reserved.; Manufacturer_Part_Number: LTC2865HMSE#TRPBF; RefDes: RefDes; Type: Type

## Sheet CAM_CONNECTOR.SchDoc
size 420 x 297 mm; SheetNumber: 19; SheetTotal: 20
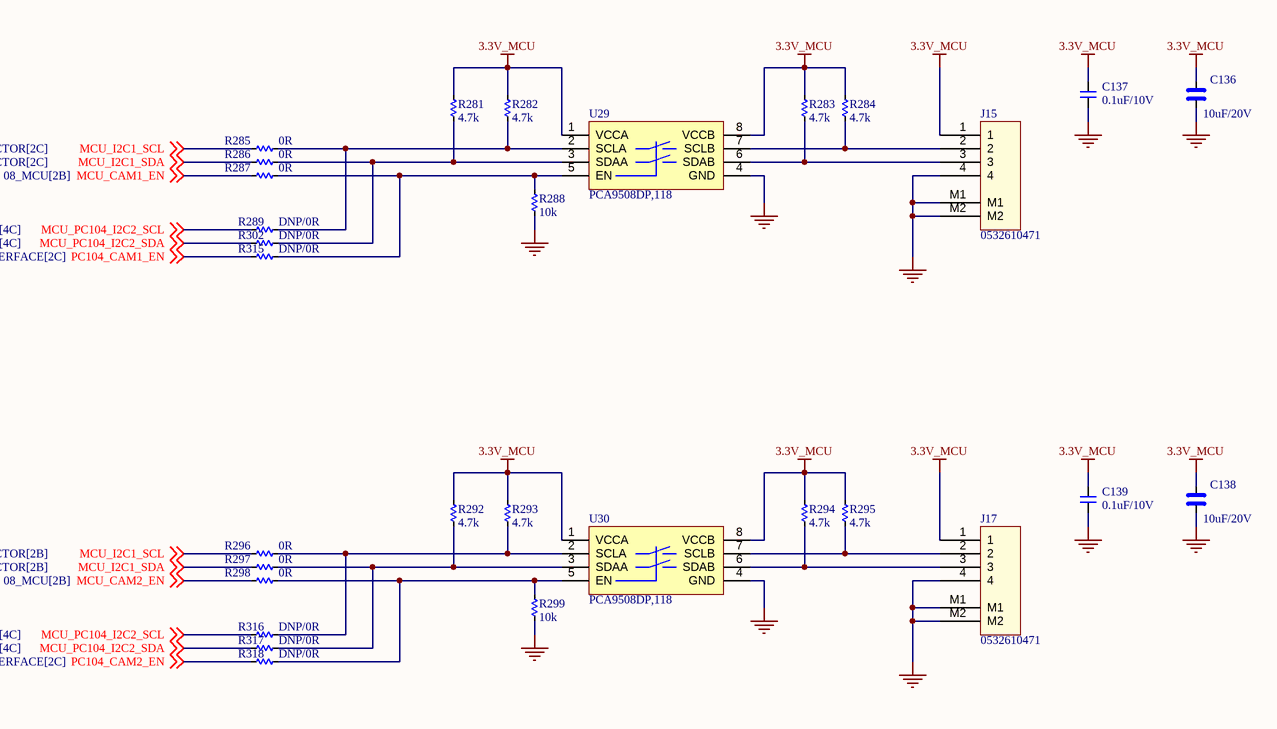
[diagram p22: CAM_CONNECTOR.SchDoc]

### Parts
C136  10uF/20V  [CAP_C_2012X110]
C137  0.1uF/10V  [CAP_C_1005X50_L]
C138  10uF/20V  [CAP_C_2012X110]
C139  0.1uF/10V  [CAP_C_1005X50_L]
J15  0532610471  [MOLEX_0532610471]
J17  0532610471  [MOLEX_0532610471]
R281  4.7k  [RES_C_1005x30_L]
R282  4.7k  [RES_C_1005x30_L]
R283  4.7k  [RES_C_1005x30_L]
R284  4.7k  [RES_C_1005x30_L]
R285  0R  [RES_C_1005x30_L]
R286  0R  [RES_C_1005x30_L]
R287  0R  [RES_C_1005x30_L]
R288  10k  [RES_C_1005X40]
R289  DNP/0R  [RES_C_1005X40]
R292  4.7k  [RES_C_1005x30_L]
R293  4.7k  [RES_C_1005x30_L]
R294  4.7k  [RES_C_1005x30_L]
R295  4.7k  [RES_C_1005x30_L]
R296  0R  [RES_C_1005x30_L]
R297  0R  [RES_C_1005x30_L]
R298  0R  [RES_C_1005x30_L]
R299  10k  [RES_C_1005X40]
R302  DNP/0R  [RES_C_1005X40]
R315  DNP/0R  [RES_C_1005X40]
R316  DNP/0R  [RES_C_1005X40]
R317  DNP/0R  [RES_C_1005X40]
R318  DNP/0R  [RES_C_1005X40]
U29  PCA9508DP,118  [TSOP8]
U30  PCA9508DP,118  [TSOP8]

### Nets
3.3V_MCU: C136.1 C137.2 C138.1 C139.2 J15.1 J17.1 R281.1 R282.1 R283.1 R284.1 R292.1 R293.1 R294.1 R295.1 U29.1(VCCA) U29.8(VCCB) U30.1(VCCA) U30.8(VCCB)
GND: C136.2 C137.1 C138.2 C139.1 J15.4 J15.M1 J15.M2 J17.4 J17.M1 J17.M2 R288.2 R299.2 U29.4(GND) U30.4(GND)
MCU_CAM1_EN: R287.1 ; off-sheet MCU_CAM1_EN
MCU_CAM2_EN: R298.1 ; off-sheet MCU_CAM2_EN
MCU_I2C1_SCL: R285.1 R296.1 ; off-sheet MCU_I2C1_SCL
MCU_I2C1_SDA: R286.1 R297.1 ; off-sheet MCU_I2C1_SDA
MCU_PC104_I2C2_SCL: R289.1 R316.1 ; off-sheet MCU_PC104_I2C2_SCL
MCU_PC104_I2C2_SDA: R302.1 R317.1 ; off-sheet MCU_PC104_I2C2_SDA
PC104_CAM1_EN: R315.1 ; off-sheet PC104_CAM1_EN
PC104_CAM2_EN: R318.1 ; off-sheet PC104_CAM2_EN
NetJ15_2: J15.2 R284.2 U29.7(SCLB)
NetJ15_3: J15.3 R283.2 U29.6(SDAB)
NetJ17_2: J17.2 R295.2 U30.7(SCLB)
NetJ17_3: J17.3 R294.2 U30.6(SDAB)
NetR281_2: R281.2 R286.2 R302.2 U29.3(SDAA)
NetR282_2: R282.2 R285.2 R289.2 U29.2(SCLA)
NetR287_2: R287.2 R288.1 R315.2 U29.5(EN)
NetR292_2: R292.2 R297.2 R317.2 U30.3(SDAA)
NetR293_2: R293.2 R296.2 R316.2 U30.2(SCLA)
NetR298_2: R298.2 R299.1 R318.2 U30.5(EN)

### Notes on the sheet
- Project
- Sub-system:
- Design by:
- Sheet title:
- Sheet:
- of
- Checked by:
- Approved by:
- Doc no:
- Revision
- Size:
- Date:

### Library data of the parts
C136 C138 = _CAP_C_High_2: CAP High Value
C137 C139 = _CAP_C_2: CAP
J15 J17 = Header 4x1_2M_1
R281-R289 R292-R299 R302 R315-R318 = _RES_B_2: RES

## Nets that join several sheets
3.3V_COM: 07_CAN (C13.1 C14.1 U3.3), POWER (5 pins), RS485 (6 pins)
3.3V_MCU: 09_CONSOLE (C18.2 J1.1 R23.2 R24.2), 08_MCU (22 pins), 10_PRAM_RTC_WDT (19 pins), 13_FLOW_Sensor (14 pins), 14_I2C_Sensor_OnBoard (17 pins), 15_HD_PUMP (8 pins), 16_SOLENOID_HB_1 (6 pins), CONNECTOR_INTERFACE (R237.2 R238.2), POWER_MEASUREMENT (11 pins), POWER (5 pins), CAM_CONNECTOR (18 pins)
3.3V_MOTOR: STEP_MOTOR_DRIVER_1 (8 pins), STEP_MOTOR_DRIVER_2 (12 pins), STEP_MOTOR_ISOLATOR_INPUT (R221.1 R223.1 R225.1 R227.1), POWER (5 pins)
5V_EXP: POWER_EFUSE (DS2.2 R1.1), POWER_MEASUREMENT (R253.2), POWER (C113.1 C116.1 VR1.3 VR2.3), FUNCTION_EFUSE (12 pins)
5V_MOTOR: STEP_MOTOR_DRIVER_1 (9 pins), STEP_MOTOR_DRIVER_2 (18 pins), POWER_MEASUREMENT (R255.2), POWER (C119.1 VR3.3), FUNCTION_EFUSE (DS7.2)
5V_MOTOR_eFuse: POWER_MEASUREMENT (R255.1), FUNCTION_EFUSE (7 pins)
5V_SLN_HD: 15_HD_PUMP (19 pins), 16_SOLENOID_HB_1 (24 pins), POWER_MEASUREMENT (R254.2), FUNCTION_EFUSE (DS6.2)
5V_SLN_HD_eFuse: POWER_MEASUREMENT (R254.1), FUNCTION_EFUSE (7 pins)
12V_EXP: POWER_EFUSE (DS1.2), IR_LED (10 pins), POWER_MEASUREMENT (R252.2)
BUS_5V: POWER_EFUSE (5 pins), CONNECTOR_INTERFACE (H2.25 H2.26)
efuse_BUS_5V: POWER_EFUSE (7 pins), POWER_MEASUREMENT (R253.1)
efuse_STX_12V: POWER_EFUSE (7 pins), POWER_MEASUREMENT (R252.1)
GND: POWER_EFUSE (23 pins), 07_CAN (5 pins), 09_CONSOLE (C18.1 J1.4 J1.M1 J1.M2), 08_MCU (36 pins), 10_PRAM_RTC_WDT (14 pins), 13_FLOW_Sensor (12 pins), 14_I2C_Sensor_OnBoard (12 pins), 15_HD_PUMP (26 pins), 16_SOLENOID_HB_1 (20 pins), IR_LED (18 pins), STEP_MOTOR_DRIVER_1 (28 pins), STEP_MOTOR_DRIVER_2 (42 pins), STEP_MOTOR_ISOLATOR_INPUT (6 pins), CONNECTOR_INTERFACE (6 pins), POWER_MEASUREMENT (6 pins), POWER (15 pins), FUNCTION_EFUSE (24 pins), RS485 (6 pins), CAM_CONNECTOR (14 pins)
STX_12V: POWER_EFUSE (5 pins), CONNECTOR_INTERFACE (H2.23 H2.24)
CAN_H: 07_CAN (R17.2 U3.7), CONNECTOR_INTERFACE (H1.03)
CAN_L: 07_CAN (R19.1 U3.6), CONNECTOR_INTERFACE (H1.01)
CANRX1: 07_CAN (U3.4), 08_MCU (R93.2)
CANTX1: 07_CAN (U3.1), 08_MCU (R98.2)
LSM6DSOX_INT: 08_MCU (R106.2), 14_I2C_Sensor_OnBoard (R149#2.2 U14#2.9)
MCU_CAM1_EN: 08_MCU (R82.2), CAM_CONNECTOR (R287.1)
MCU_CAM2_EN: 08_MCU (R103.2), CAM_CONNECTOR (R298.1)
MCU_CONSOLE_RX: 09_CONSOLE (R24.1 R26.2), 08_MCU (R68.1)
MCU_CONSOLE_TX: 09_CONSOLE (R23.1 R25.2), 08_MCU (R70.1)
MCU_FRAM_nCS: 08_MCU (R59.2), 10_PRAM_RTC_WDT (R114.1 U6.1)
MCU_HD4_I2C_EN: 08_MCU (R102.2), 15_HD_PUMP (R163.1 U16.5)
MCU_HD_I2C_EN: 08_MCU (R73.2), 15_HD_PUMP (R332.1 U12.5)
MCU_I2C0_SCL: 08_MCU (R36.2), 13_FLOW_Sensor (R127.2 U9.2 U10.2), 15_HD_PUMP (R136.2 R157.2 R161.1 R321.1), POWER_MEASUREMENT (R247.2 U25.4)
MCU_I2C0_SDA: 08_MCU (R33.2), 13_FLOW_Sensor (R126.2 U9.3 U10.3), 15_HD_PUMP (R137.2 R158.2 R162.1 R331.1), POWER_MEASUREMENT (R248.2 U25.5)
MCU_I2C1_SCL: 08_MCU (R97.1), 10_PRAM_RTC_WDT (R119.1 U7.4), 14_I2C_Sensor_OnBoard (R143.1 R150#2.1), CAM_CONNECTOR (R285.1 R296.1)
MCU_I2C1_SDA: 08_MCU (R92.1), 10_PRAM_RTC_WDT (R120.1 U7.5), 14_I2C_Sensor_OnBoard (R142.2 R151#2.1), CAM_CONNECTOR (R286.1 R297.1)
MCU_IR_LED_1_PWM: 08_MCU (R79.2), IR_LED (R174.2 R175.1)
MCU_IR_LED_2_PWM: 08_MCU (R303.2), IR_LED (R177.2 R178.1)
MCU_PC104_I2C2_SCL: 08_MCU (R74.1), CONNECTOR_INTERFACE (R238.1 R246.2), CAM_CONNECTOR (R289.1 R316.1)
MCU_PC104_I2C2_SDA: 08_MCU (R72.1), CONNECTOR_INTERFACE (R237.1 R244.2), CAM_CONNECTOR (R302.1 R317.1)
MCU_PRAM_SPI1_nCS: 08_MCU (R308.2), 10_PRAM_RTC_WDT (U28#1.1)
MCU_RTC_CLKOUT: 08_MCU (R86.2), 10_PRAM_RTC_WDT (R117.1 U7.3)
MCU_RTC_INT: 08_MCU (R87.2), 10_PRAM_RTC_WDT (R118.1 U7.7)
MCU_SENSOR1_nIRQ: 08_MCU (R64.1), 13_FLOW_Sensor (J4.1)
MCU_SENSOR2_nIRQ: 08_MCU (R66.1), 13_FLOW_Sensor (J5.1)
MCU_SPI0_CMD_SOLE_A: 08_MCU (R105.2), 16_SOLENOID_HB_1 (R171.1)
MCU_SPI0_CMD_SOLE_B: 08_MCU (R76.1), 16_SOLENOID_HB_1 (R416.1)
MCU_SPI0_nCS_SOLE_A: 08_MCU (R104.1), 16_SOLENOID_HB_1 (R167.1)
MCU_SPI0_nCS_SOLE_B: 08_MCU (R75.1), 16_SOLENOID_HB_1 (R412.1)
MCU_SPI1_MISO: 08_MCU (R108.2 R110.2), 10_PRAM_RTC_WDT (U28#1.2)
MCU_SPI1_MOSI: 08_MCU (R111.2), 10_PRAM_RTC_WDT (U28#1.5)
MCU_SPI1_SCK: 08_MCU (R107.2), 10_PRAM_RTC_WDT (U28#1.6)
MCU_UART4_RX: 08_MCU (R57.1), RS485 (U28#2.1)
MCU_UART4_TX: 08_MCU (R34.1), RS485 (U28#2.4)
MCU_USART_RXD2: 08_MCU (R54.1), 10_PRAM_RTC_WDT (U6.2), 16_SOLENOID_HB_1 (R165.2 R166.1 R410.2 R411.1)
MCU_USART_SCK2: 08_MCU (R56.1), 10_PRAM_RTC_WDT (U6.6), 16_SOLENOID_HB_1 (R168.1 R413.1)
MCU_USART_TXD2: 08_MCU (R55.1), 10_PRAM_RTC_WDT (U6.5), 16_SOLENOID_HB_1 (R169.1 R414.1)
MCU_WD_DONE: 08_MCU (R83.1), 10_PRAM_RTC_WDT (U8.4)
MCU_WD_nRESET: 08_MCU (R80.2), 10_PRAM_RTC_WDT (R123.1)
MCU_WD_WAKE: 08_MCU (R85.1), 10_PRAM_RTC_WDT (U8.5)
NetR61_2: 08_MCU (R61.2), POWER_MEASUREMENT (R250.2 U25.1)
PC104_CAM1_EN: CONNECTOR_INTERFACE (R304.1), CAM_CONNECTOR (R315.1)
PC104_CAM2_EN: CONNECTOR_INTERFACE (R305.1), CAM_CONNECTOR (R318.1)
PC104_I2C_IRQ1: 08_MCU (R101.2), CONNECTOR_INTERFACE (R243.1)
POW_ONOFF_MOTOR: 08_MCU (R37.1), FUNCTION_EFUSE (R267.2 R272.1 U27.1)
POW_ONOFF_SLN_HD: 08_MCU (R32.1), FUNCTION_EFUSE (R259.2 R264.1 U26.1)
POW_ONOFF_STX_12V: POWER_EFUSE (R1.2 R6.1 U1.1), 08_MCU (R28.1)
RX_MOTOR_2: STEP_MOTOR_DRIVER_1 (U20.5), STEP_MOTOR_DRIVER_2 (R198.2 U22.14)
RX_MOTOR_3: STEP_MOTOR_DRIVER_1 (U20.4), STEP_MOTOR_DRIVER_2 (R211.2 U23.14)
SENSOR1_EN: 08_MCU (R88.2), 13_FLOW_Sensor (R130.1 U9.5)
SENSOR2_EN: 08_MCU (R90.2), 13_FLOW_Sensor (R133.1 U10.5)
TEMP _SENSOR: 08_MCU (R306.1), 14_I2C_Sensor_OnBoard (U31.2)
TX_MOTOR_2: STEP_MOTOR_DRIVER_1 (U20.14), STEP_MOTOR_DRIVER_2 (R198.1)
TX_MOTOR_3: STEP_MOTOR_DRIVER_1 (U20.11), STEP_MOTOR_DRIVER_2 (R211.1)